# EAGLE design amp (EAGLE 7.7.0)
Odd man out headphone amplifier
CNAME: Odd Man Out Headphone Amplifier; CREVISION: 1; DESIGNER: Eugene Zagidullin
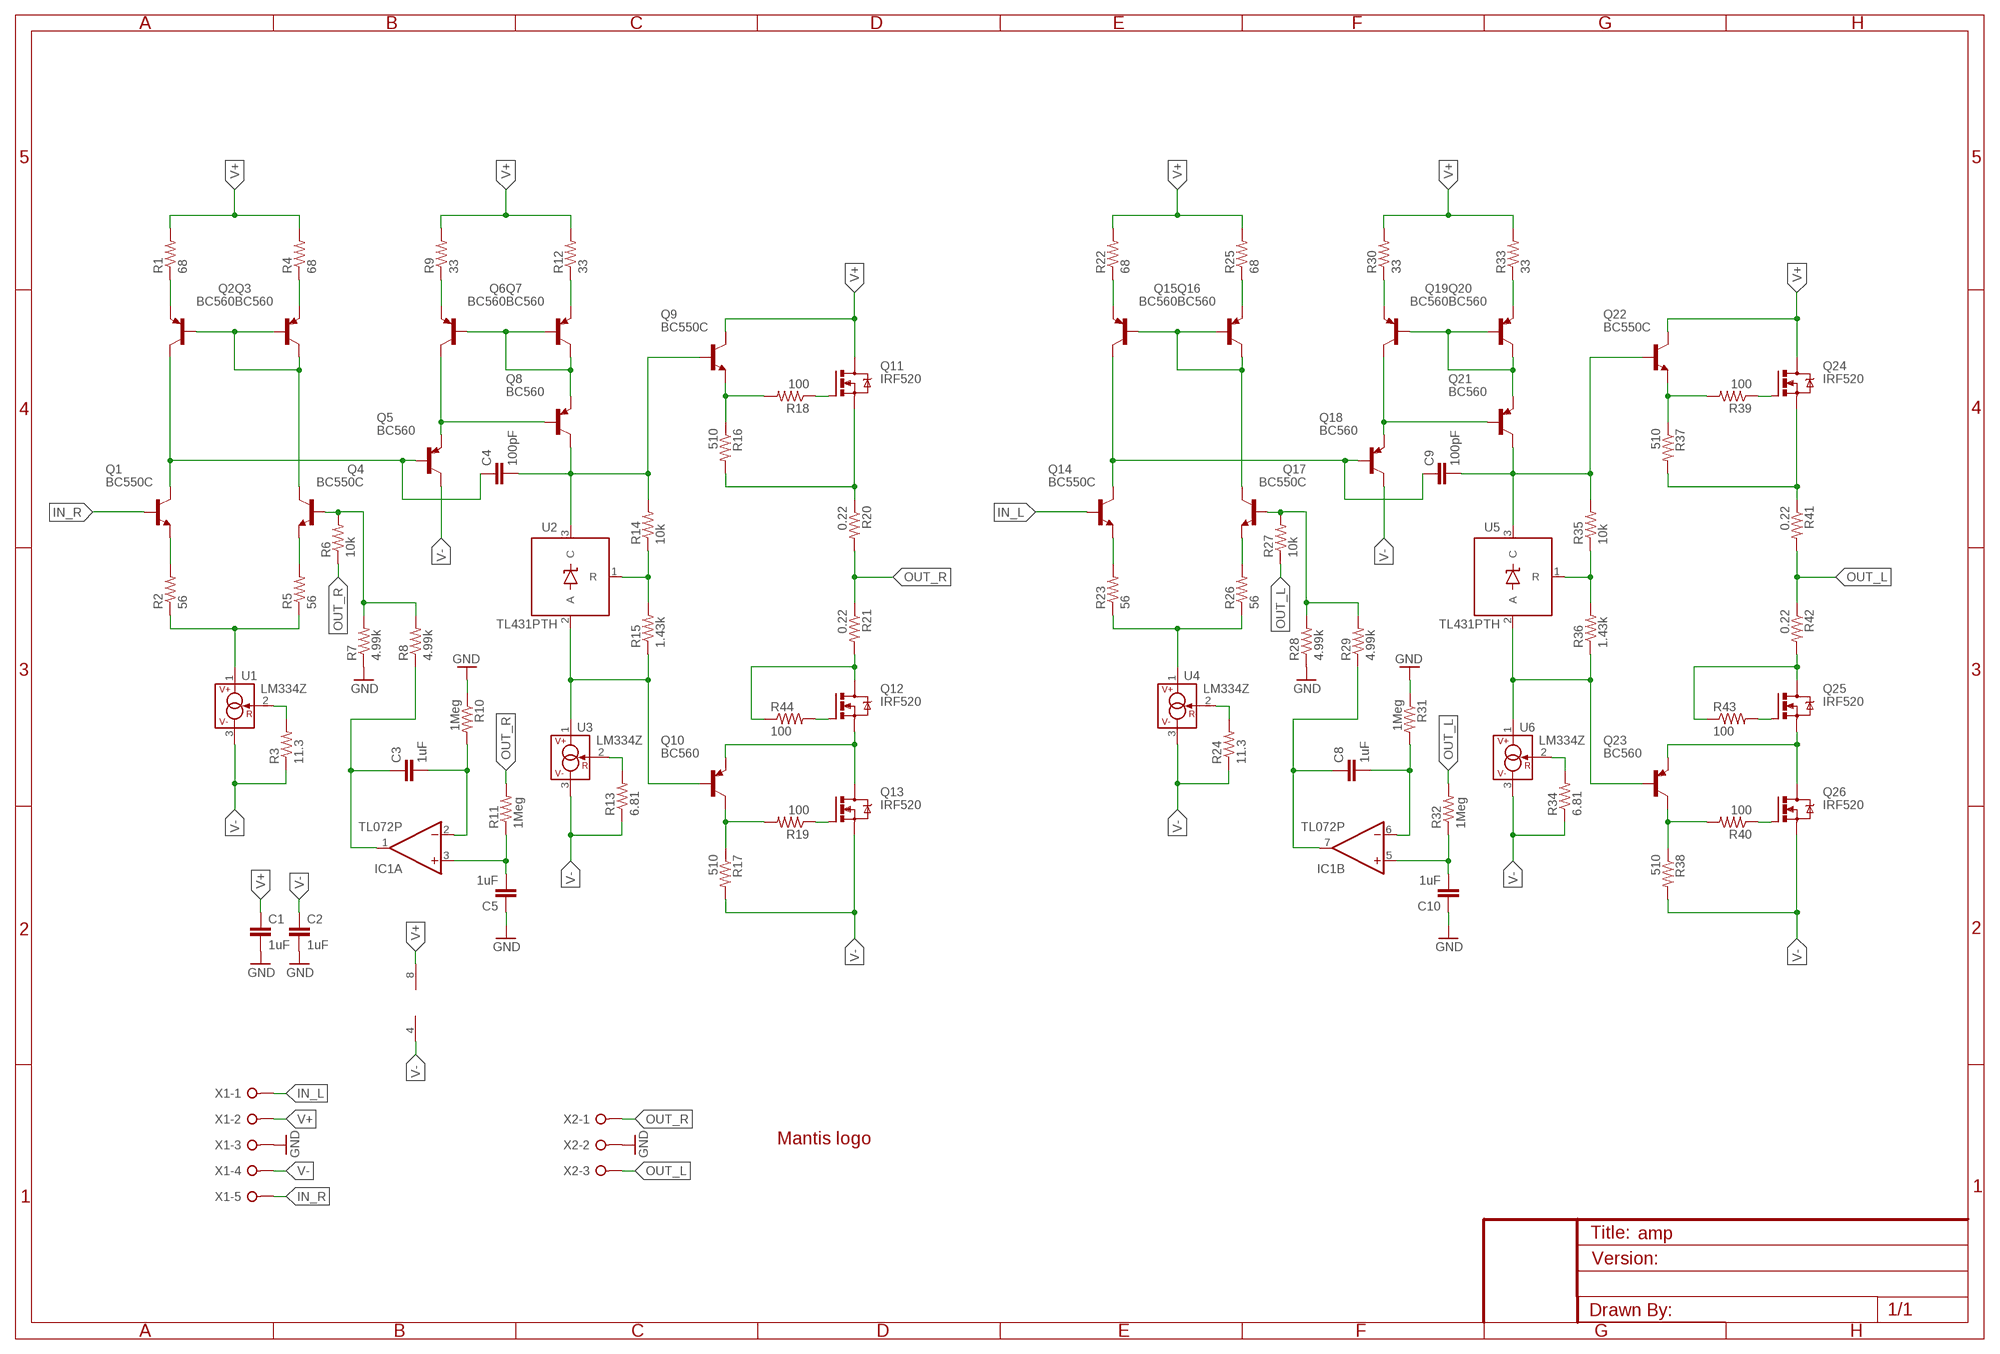
[diagram p0: schematic, sheet 1]

## Parts
C1  1uF  CAPPTH  [CAP-PTH-SMALL]
C2  1uF  CAPPTH  [CAP-PTH-SMALL]
C3  1uF  C5/5.5  [C5B5.5]
C4  100pF  C5/4.5  [C5B4.5]
C5  1uF  C5/5.5  [C5B5.5]
C8  1uF  C5/5.5  [C5B5.5]
C9  100pF  C5/4.5  [C5B4.5]
C10  1uF  C5/5.5  [C5B5.5]
IC1  TL072P  [DIL08]
LOGO1  LOGO-MANTIS  [LOGO-MANTIS]
Q1  BC550C  [TO92-EBC]
Q2  BC560  [TO92-EBC]
Q3  BC560  [TO92-EBC]
Q4  BC550C  [TO92-EBC]
Q5  BC560  [TO92-EBC]
Q6  BC560  [TO92-EBC]
Q7  BC560  [TO92-EBC]
Q8  BC560  [TO92-EBC]
Q9  BC550C  [TO92-EBC]
Q10  BC560  [TO92-EBC]
Q11  IRF520  [TO220BV]
Q12  IRF520  [TO220BV]
Q13  IRF520  [TO220BV]
Q14  BC550C  [TO92-EBC]
Q15  BC560  [TO92-EBC]
Q16  BC560  [TO92-EBC]
Q17  BC550C  [TO92-EBC]
Q18  BC560  [TO92-EBC]
Q19  BC560  [TO92-EBC]
Q20  BC560  [TO92-EBC]
Q21  BC560  [TO92-EBC]
Q22  BC550C  [TO92-EBC]
Q23  BC560  [TO92-EBC]
Q24  IRF520  [TO220BV]
Q25  IRF520  [TO220BV]
Q26  IRF520  [TO220BV]
R1  68  RESISTORPTH-1/4W  [AXIAL-0.4]
R2  56  RESISTORPTH-1/4W  [AXIAL-0.4]
R3  11.3  RESISTORPTH-1/4W  [AXIAL-0.4]
R4  68  RESISTORPTH-1/4W  [AXIAL-0.4]
R5  56  RESISTORPTH-1/4W  [AXIAL-0.4]
R6  10k  RESISTORPTH-1/4W  [AXIAL-0.4]
R7  4.99k  RESISTORPTH-1/4W  [AXIAL-0.4]
R8  4.99k  RESISTORPTH-1/4W  [AXIAL-0.4]
R9  33  RESISTORPTH-1/4W  [AXIAL-0.4]
R10  1Meg  RESISTORPTH-1/4W  [AXIAL-0.4]
R11  1Meg  RESISTORPTH-1/4W  [AXIAL-0.4]
R12  33  RESISTORPTH-1/4W  [AXIAL-0.4]
R13  6.81  RESISTORPTH-1/4W  [AXIAL-0.4]
R14  10k  RESISTORPTH-1/4W  [AXIAL-0.4]
R15  1.43k  RESISTORPTH-1/4W  [AXIAL-0.4]
R16  510  RESISTORPTH-1/4W  [AXIAL-0.4]
R17  510  RESISTORPTH-1/4W  [AXIAL-0.4]
R18  100  RESISTORPTH-1/4W  [AXIAL-0.4]
R19  100  RESISTORPTH-1/4W  [AXIAL-0.4]
R20  0.22  RESISTORPTH-1/4W  [AXIAL-0.4]
R21  0.22  RESISTORPTH-1/4W  [AXIAL-0.4]
R22  68  RESISTORPTH-1/4W  [AXIAL-0.4]
R23  56  RESISTORPTH-1/4W  [AXIAL-0.4]
R24  11.3  RESISTORPTH-1/4W  [AXIAL-0.4]
R25  68  RESISTORPTH-1/4W  [AXIAL-0.4]
R26  56  RESISTORPTH-1/4W  [AXIAL-0.4]
R27  10k  RESISTORPTH-1/4W  [AXIAL-0.4]
R28  4.99k  RESISTORPTH-1/4W  [AXIAL-0.4]
R29  4.99k  RESISTORPTH-1/4W  [AXIAL-0.4]
R30  33  RESISTORPTH-1/4W  [AXIAL-0.4]
R31  1Meg  RESISTORPTH-1/4W  [AXIAL-0.4]
R32  1Meg  RESISTORPTH-1/4W  [AXIAL-0.4]
R33  33  RESISTORPTH-1/4W  [AXIAL-0.4]
R34  6.81  RESISTORPTH-1/4W  [AXIAL-0.4]
R35  10k  RESISTORPTH-1/4W  [AXIAL-0.4]
R36  1.43k  RESISTORPTH-1/4W  [AXIAL-0.4]
R37  510  RESISTORPTH-1/4W  [AXIAL-0.4]
R38  510  RESISTORPTH-1/4W  [AXIAL-0.4]
R39  100  RESISTORPTH-1/4W  [AXIAL-0.4]
R40  100  RESISTORPTH-1/4W  [AXIAL-0.4]
R41  0.22  RESISTORPTH-1/4W  [AXIAL-0.4]
R42  0.22  RESISTORPTH-1/4W  [AXIAL-0.4]
R43  100  RESISTORPTH-1/4W  [AXIAL-0.4]
R44  100  RESISTORPTH-1/4W  [AXIAL-0.4]
U1  LM334Z  [TO-92]
U2  TL431PTH  [TO-92]
U3  LM334Z  [TO-92]
U4  LM334Z  [TO-92]
U5  TL431PTH  [TO-92]
U6  LM334Z  [TO-92]
X1  W237-05P  [W237-5P]
X2  W237-3E  [W237-3E]

## Nets
GND: C1.2 C2.2 C5.1 C10.1 R7.P$1 R10.P$1 R28.P$1 R31.P$1 X1.3 X2.2
IN_L: Q14.B X1.1
IN_R: Q1.B X1.5
N$1: Q2.B Q3.B Q3.C Q4.C
N$2: C4.1 Q1.C Q2.C Q5.B
N$3: Q2.E R1.P$1
N$4: Q3.E R4.P$1
N$5: Q1.E R2.P$2
N$6: Q4.E R5.P$2
N$7: R2.P$1 R5.P$1 U1.1(V+)
N$8: R3.P$2 U1.2(R)
N$9: Q6.B Q7.B Q7.C Q8.E
N$10: Q6.E R9.P$1
N$11: Q7.E R12.P$1
N$12: Q5.E Q6.C Q8.B
N$13: C4.2 Q8.C Q9.B R14.P$2 U2.3(C)
N$14: R14.P$1 R15.P$2 U2.1(R)
N$15: Q10.B R15.P$1 U2.2(A) U3.1(V+)
N$16: Q13.G R19.P$1
N$17: R13.P$2 U3.2(R)
N$18: Q10.C R17.P$1 R19.P$2
N$19: Q9.E R16.P$1 R18.P$2
N$20: Q11.G R18.P$1
N$21 [out]: Q10.E Q12.S Q13.D
N$22: C3.1 IC1.1(A:OUT) R8.P$1
N$23 [out]: Q11.S R16.P$2 R20.P$1
N$24: C3.2 IC1.2(A:-IN) R10.P$2
N$25 [out]: Q12.D R21.P$2 R44.P$1
N$26: C5.2 IC1.3(A:+IN) R11.P$1
N$27: Q15.B Q16.B Q16.C Q17.C
N$28: Q4.B R6.P$2 R7.P$2 R8.P$2
N$29: Q15.E R22.P$1
N$30: Q16.E R25.P$1
N$31: C9.1 Q14.C Q15.C Q18.B
N$32: Q14.E R23.P$2
N$33: Q17.E R26.P$2
N$34: R23.P$1 R26.P$1 U4.1(V+)
N$35: R24.P$2 U4.2(R)
N$36: Q19.B Q20.B Q20.C Q21.E
N$37: Q19.E R30.P$1
N$38: Q20.E R33.P$1
N$39: Q18.E Q19.C Q21.B
N$40: C9.2 Q21.C Q22.B R35.P$2 U5.3(C)
N$41: R35.P$1 R36.P$2 U5.1(R)
N$42: Q23.B R36.P$1 U5.2(A) U6.1(V+)
N$43: R34.P$2 U6.2(R)
N$44: Q25.G R43.P$2
N$45: Q12.G R44.P$2
N$48 [out]: Q23.E Q25.S Q26.D
N$49 [out]: Q24.S R37.P$2 R41.P$1
N$50 [out]: Q25.D R42.P$2 R43.P$1
N$51: C8.1 IC1.7(B:OUT) R29.P$1
N$52: C8.2 IC1.6(B:-IN) R31.P$2
N$53: C10.2 IC1.5(B:+IN) R32.P$1
N$54: Q17.B R27.P$2 R28.P$2 R29.P$2
N$1044: Q26.G R40.P$1
N$1045: Q23.C R38.P$1 R40.P$2
N$1046: Q22.E R37.P$1 R39.P$2
N$1047: Q24.G R39.P$1
OUT_L [out]: R27.P$1 R32.P$2 R41.P$2 R42.P$1 X2.3
OUT_R [out]: R6.P$1 R11.P$2 R20.P$2 R21.P$1 X2.1
V+ [pwr]: C1.1 IC1.8(P:V+) Q9.C Q11.D Q22.C Q24.D R1.P$2 R4.P$2 R9.P$2 R12.P$2 R22.P$2 R25.P$2 R30.P$2 R33.P$2 X1.2
V- [pwr]: C2.1 IC1.4(P:V-) Q5.C Q13.S Q18.C Q26.S R3.P$1 R13.P$1 R17.P$2 R24.P$1 R34.P$1 R38.P$2 U1.3(V-) U3.3(V-) U4.3(V-) U6.3(V-) X1.4

## Library data of the parts
C1 C2 = SparkFun-Capacitors:CAP: Capacitor Standard 0603 ceramic capacitor, and 0.1" leaded capacitor.
C3-C5 C8-C10 = capacitor-wima:C: CAPACITOR naming: grid - package width
IC1 = linear:TL072: OP AMP
LOGO1 = my:LOGO-MANTIS: Mantis logo
Q1 Q4 Q9 Q14 Q17 Q22 = transistor-npn:BC550*: NPN Transistor
Q2 Q3 Q5-Q8 Q10 Q15 Q16 Q18-Q21 Q23 = transistor-pnp:BC560*: PNP Transistror
Q11-Q13 Q24-Q26 = transistor-power:IRF520: HEXFET Power MOSFET
R1-R44 = SparkFun-Resistors:RESISTOR: Resistor Basic schematic elements and footprints for 0603, 1206, and PTH resistors.
U1 U3 U4 U6 = my:LM334Z: 3-Terminal Adjustable Current Sources Source: www.national.com/pf/LM/LM334.html | LM134.pdf
U2 U5 = SparkFun-AnalogIC:TL431: Precision Programmable Reference
X1 = con-wago-508:W237-05P: WAGO SREW CLAMP; OC_FARNELL: unknown; OC_NEWARK: unknown
X2 = con-wago-508:W237-3E: WAGO SREW CLAMP; OC_FARNELL: unknown; OC_NEWARK: unknown

## Net classes
0 default: width 0.61 mm
1 pwr: width 1.27 mm
2 out: width 0.813 mm

## Board
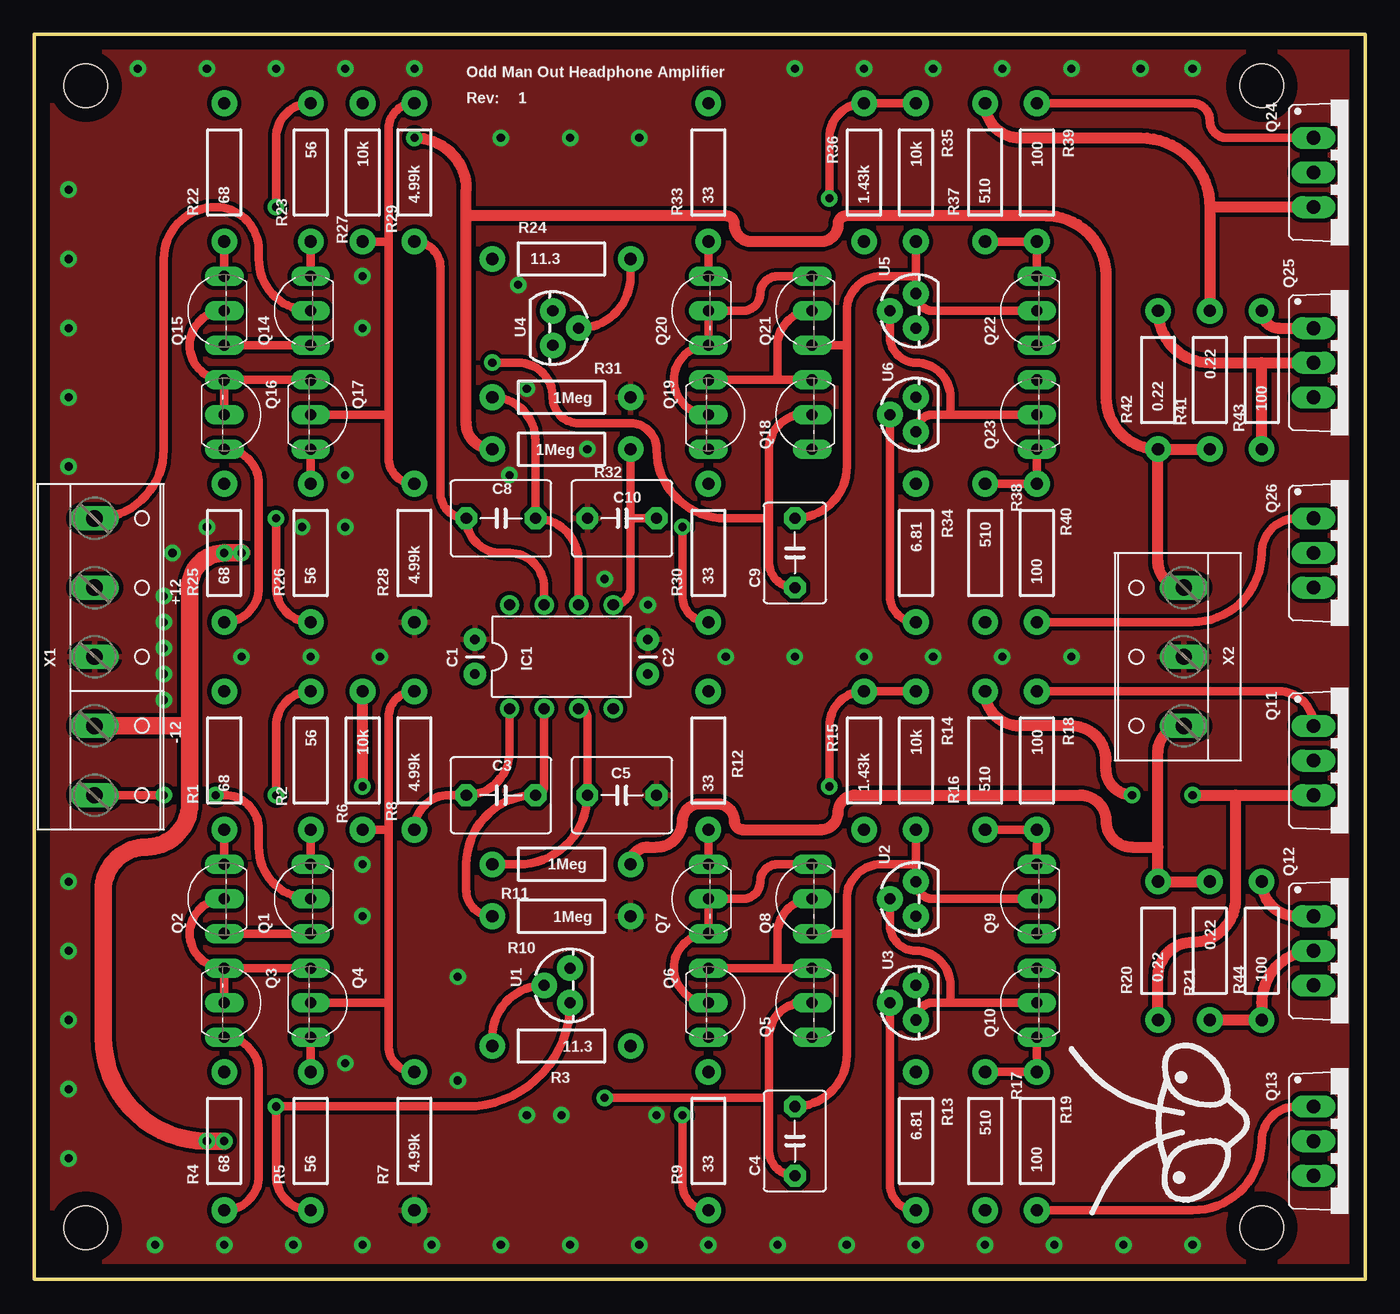
[diagram p1: board, top side]
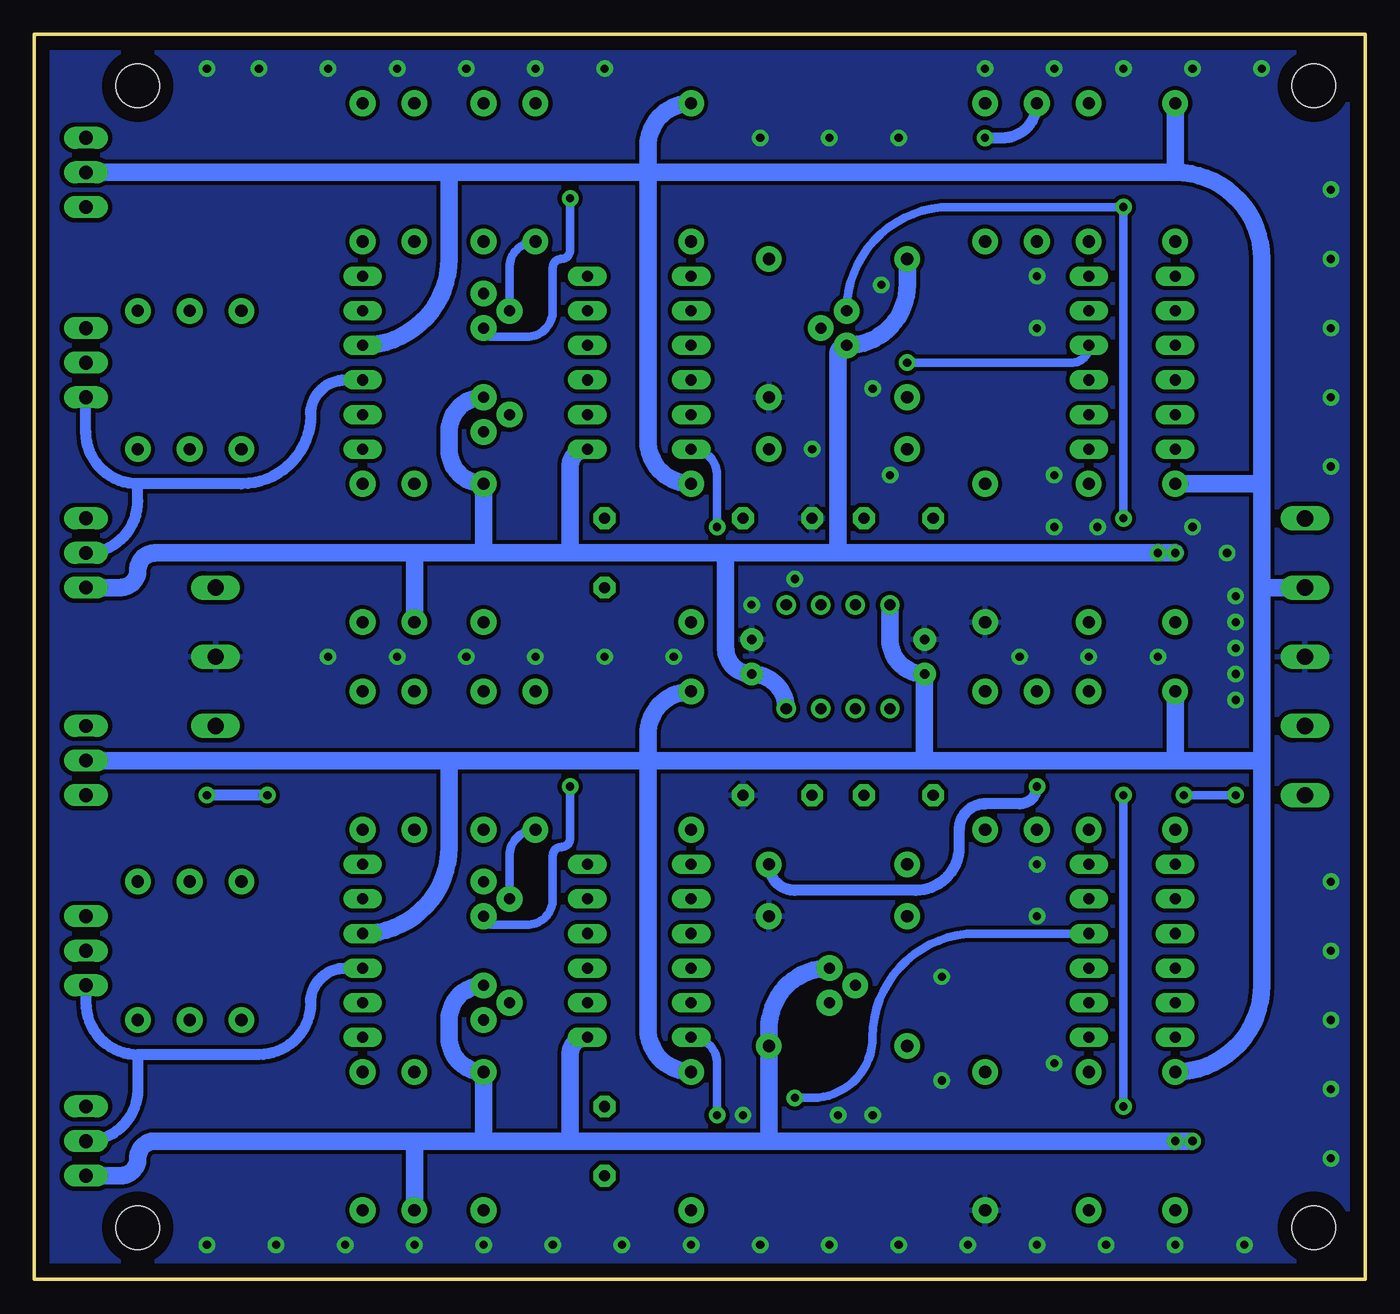
[diagram p2: board, bottom side, seen from below]

Size 97.79 x 91.44 mm. Coordinates in mm from the lower left corner, seen from the top.
Outline: 97.79,0 97.79,91.44 0,91.44 0,0 97.79,0
Copper layers (1*16): Top 0.035mm / dielectric 1.5mm / Bottom 0.035mm
Design rules "default *": minimum track width 12mil, minimum drill 22mil, track to track 12mil, track to pad 12mil, pad to pad 8mil, via to via 8mil, smd to smd 0mil, copper to edge 40mil, drill to drill 12mil, minimum pad ring 12mil, minimum via ring 12mil, stop-mask expansion 4mil, vias tented up to drill 0mil, thermal gap 10mil
Holes 3.2 mm at 3.81,3.81 90.17,3.81 3.81,87.63 90.17,87.63

### Footprints (pad centres in the part's own frame; a part is rotated, then mirrored left to right if it is on the bottom)
CAP-PTH-SMALL = drill 0.7 pad 1.651: 1 0,0; 2 2.54,0
C5B5.5 = drill 0.813 pad 1.6 octagon: 1 -2.54,0; 2 2.54,0
C5B4.5 = drill 0.813 pad 1.6 octagon: 1 -2.54,0; 2 2.54,0
DIL08 = drill 0.813 pad 1.27: 1 -3.81,-3.81; 2 -1.27,-3.81; 3 1.27,-3.81; 4 3.81,-3.81; 5 3.81,3.81; 6 1.27,3.81; 7 -1.27,3.81; 8 -3.81,3.81
TO92-EBC = drill 0.813 long: B 0,-1.27; C -2.54,-1.27; E 2.54,-1.27
TO220BV = drill 1.016 long: D 0,-2.54; G -2.54,-2.54; S 2.54,-2.54
AXIAL-0.4 = drill 0.9 pad 1.88: P$1 -5.08,0; P$2 5.08,0
TO-92 = drill 0.813 pad 1.88: 1 -1.27,0; 2 0,1.905; 3 1.27,0
W237-5P = drill 1.194 long: 1 -10.16,-0.635; 2 -5.08,-0.635; 3 0,-0.635; 4 5.08,-0.635; 5 10.16,-0.635
W237-3E = drill 1.194 long: 1 -5.08,-0.635; 2 0,-0.635; 3 5.08,-0.635

### Placement (x,y rotation side)
C1  32.38,44.45 90 top
C2  45.09,44.45 90 top
C3  34.29,35.56 0 top
C4  55.88,10.16 90 top
C5  43.18,35.56 180 top
C8  34.29,55.88 0 top
C9  55.88,53.34 90 top
C10  43.18,55.88 0 top
IC1  38.73,45.72 0 top
LOGO1  82.55,11.43 90 top
Q1  19.05,27.94 90 top
Q2  12.7,27.94 90 top
Q3  15.24,20.32 270 top
Q4  21.59,20.32 270 top
Q5  55.88,20.32 90 top
Q6  50.8,20.32 270 top
Q7  48.26,27.94 90 top
Q8  55.88,27.94 90 top
Q9  72.39,27.94 90 top
Q10  72.39,20.32 90 top
Q11  96.52,38.1 270 top
Q12  96.52,24.13 270 top
Q13  96.52,10.16 270 top
Q14  19.05,71.12 90 top
Q15  12.7,71.12 90 top
Q16  15.24,63.5 270 top
Q17  21.59,63.5 270 top
Q18  55.88,63.5 90 top
Q19  50.8,63.5 270 top
Q20  48.26,71.12 90 top
Q21  55.88,71.12 90 top
Q22  72.39,71.12 90 top
Q23  72.39,63.5 90 top
Q24  96.52,81.28 270 top
Q25  96.52,67.31 270 top
Q26  96.52,53.34 270 top
R1  13.97,38.1 90 top
R2  20.32,38.1 270 top
R3  38.73,17.14 180 top
R4  13.97,10.16 90 top
R5  20.32,10.16 90 top
R6  24.13,38.1 270 top
R7  27.94,10.16 90 top
R8  27.94,38.1 90 top
R9  49.53,10.16 90 top
R10  38.73,26.67 180 top
R11  38.73,30.48 0 top
R12  49.53,38.1 90 top
R13  64.77,10.16 270 top
R14  64.77,38.1 270 top
R15  60.96,38.1 90 top
R16  69.85,38.1 90 top
R17  69.85,10.16 270 top
R18  73.66,38.1 270 top
R19  73.66,10.16 90 top
R20  82.55,24.13 90 top
R21  86.36,24.13 270 top
R22  13.97,81.28 90 top
R23  20.32,81.28 270 top
R24  38.73,74.93 0 top
R25  13.97,53.34 90 top
R26  20.32,53.34 90 top
R27  24.13,81.28 270 top
R28  27.94,53.34 90 top
R29  27.94,81.28 90 top
R30  49.53,53.34 90 top
R31  38.73,64.77 180 top
R32  38.73,60.96 180 top
R33  49.53,81.28 90 top
R34  64.77,53.34 270 top
R35  64.77,81.28 270 top
R36  60.96,81.28 90 top
R37  69.85,81.28 90 top
R38  69.85,53.34 270 top
R39  73.66,81.28 270 top
R40  73.66,53.34 90 top
R41  86.36,66.04 270 top
R42  82.55,66.04 90 top
R43  90.17,66.04 90 top
R44  90.17,24.13 90 top
U1  39.37,21.59 90 top
U2  64.77,27.94 90 top
U3  64.77,20.32 90 top
U4  38.1,69.85 270 top
U5  64.77,71.12 90 top
U6  64.77,63.5 90 top
X1  5.08,45.72 270 top
X2  83.82,45.72 90 top

### Tracks (layer width: path | path; a pad name or v marks a point on that pad's centre or on a via)
GND  (via drill 0.6)
  other vias: 24.13,26.67 24.13,30.48 22.86,15.88 19.68,55.24 22.86,55.24 24.13,73.66 22.86,59.05 8.89,2.54 13.97,2.54 19.05,2.54 24.13,2.54 29.21,2.54 34.29,2.54 39.37,2.54 44.45,2.54 49.53,2.54 54.61,2.54 59.69,2.54 64.77,2.54 69.85,2.54 74.93,2.54 80.01,2.54 85.09,2.54 2.54,8.89 2.54,13.97 2.54,19.05 2.54,24.13 2.54,29.21 9.53,42.55 9.53,44.45 9.53,46.35 9.53,48.26 9.53,50.16 10.16,53.34 12.7,55.24 2.54,59.69 2.54,64.77 2.54,69.85 2.54,74.93 2.54,80.01 7.62,88.9 12.7,88.9 17.78,88.9 22.86,88.9 27.94,88.9 55.88,88.9 60.96,88.9 66.04,88.9 71.12,88.9 76.2,88.9 81.28,88.9 85.09,88.9 15.24,45.72 20.32,45.72 25.4,45.72 50.8,45.72 55.88,45.72 60.96,45.72 66.04,45.72 71.12,45.72 76.2,45.72 34.29,83.82 39.37,83.82 44.45,83.82 24.13,69.85 41.91,51.43 45.09,49.53 34.92,59.05 36.2,65.41 40.64,60.96 35.56,73.02 36.2,12.07 38.73,12.07 45.72,12.07 31.11,14.61 31.11,22.23
  pour Top (isolate 0.305): 0,91.44 97.79,91.44 97.79,0 0,0
  pour Bottom (isolate 0.305): 0,91.44 97.79,91.44 97.79,0 0,0
IN_L
  Top 0.61: Q14.B arc-90 16.51,74.93 16.51,75.56 arc90 13.34,78.74 arc90 9.53,74.93 9.53,60.96 arc-90 X1.1
IN_R  (via drill 0.6)
  Top 0.61: Q1.B arc-90 16.51,31.75 16.51,33.02 arc90 13.97,35.56 v13.34,35.56 | X1.5 v9.53,35.56
  Bottom 0.61: v9.53,35.56 v13.34,35.56
N$1
  Top 0.61: Q3.C Q4.C | Q3.C Q3.B | Q3.C arc-90 11.43,25.4 arc-90 Q2.B
N$2  (via drill 0.6)
  Top 0.61: Q2.C Q1.C | 55.88,20.32 Q5.B 56.52,20.32 arc90 53.98,17.78 53.98,13.34 | 53.98,13.34 53.98,9.53 arc90 C4.1 | v41.91,13.34 53.98,13.34
  Bottom 0.61: Q1.C 28.57,25.4 arc-90 36.2,17.78 arc90 40.64,13.34 v41.91,13.34
N$3
  Top 0.61: Q2.E R1.P$1
N$4
  Top 0.61: R4.P$1 arc90 16.51,7.62 16.51,15.24 arc90 Q3.E
N$5
  Top 0.61: Q1.E R2.P$2
N$6
  Top 0.61: Q4.E R5.P$2
N$7  (via drill 0.6)
  Top 0.61: R5.P$1 arc-90 17.78,7.62 v17.78,12.7 31.75,12.7 arc90 U1.1 | v17.78,35.56 17.78,40.64 arc-90 R2.P$1
  Bottom 0.61: v17.78,12.7 v17.78,35.56
N$8
  Top 0.61: U1.2 arc90 33.66,17.78 R3.P$2
N$9
  Top 0.61: Q8.E 54.61,30.48 arc90 53.34,29.21 arc-90 52.07,27.94 Q7.B Q7.C arc90 46.99,22.86 arc90 Q6.B
N$10  (via drill 0.6)
  Top 0.61: R9.P$1 arc-90 47.62,6.99 v47.62,12.07
  Bottom 0.61: v47.62,12.07 47.62,15.88 arc-90 Q6.E
N$11
  Top 0.61: Q7.E R12.P$1
N$12
  Top 0.61: Q6.C 54.61,22.86 | 54.61,22.86 Q5.E | Q8.B arc90 54.61,25.4 54.61,22.86
N$13
  Top 0.61: C4.2 arc90 59.69,16.51 59.69,25.4 | 59.69,25.4 59.69,27.94 arc-90 62.23,30.48 64.77,30.48 | 64.77,30.48 U2.3 arc90 66.04,27.94 Q9.B | 64.77,30.48 R14.P$2 | Q8.C 59.69,25.4
N$14  (via drill 0.6)
  Top 0.61: v58.42,36.2 58.42,40.64 arc-90 R15.P$2 R14.P$1
  Bottom 0.61: U2.1 arc-90 64.14,26.03 61.59,26.03 arc-90 59.69,27.94 59.69,31.12 arc90 59.05,31.75 arc-90 58.42,32.38 v58.42,36.2
N$15
  Top 0.61: U3.1 arc-90 66.04,20.32 67.31,20.32 | 67.31,20.32 Q10.B | U2.2 62.87,26.03 arc90 64.77,24.13 arc-90 67.31,21.59 67.31,20.32
  Bottom 0.61: U2.2 62.87,31.12 arc90 R15.P$1
N$16
  Top 0.61: R19.P$1 85.09,5.08 arc90 90.17,10.16 arc-90 92.71,12.7 Q13.G
N$17
  Top 0.61: R13.P$2 arc-90 62.87,6.99 U3.2
N$18
  Top 0.61: Q10.C R19.P$2 R17.P$1
N$19
  Top 0.61: R16.P$1 R18.P$2 Q9.E
N$20
  Top 0.61: R18.P$1 91.44,43.18 arc-90 Q11.G
N$21
  Bottom 0.813: Q10.E 74.93,22.86 arc-90 77.47,20.32 arc90 81.28,16.51 90.17,16.51 | Q12.S 93.98,20.32 arc-90 90.17,16.51 | 90.17,16.51 90.17,13.97 arc90 Q13.D
N$22
  Top 0.61: IC1.1 34.92,38.73 arc-90 C3.1 30.48,35.56 arc90 R8.P$1
N$23  (via drill 0.6)
  Top 0.813: R20.P$1 82.55,22.23 arc-90 85.09,24.77 arc90 88.27,27.94 88.27,35.56 | R16.P$2 arc90 72.39,40.64 76.2,40.64 arc-90 78.74,38.1 78.74,37.46 arc90 v80.65,35.56 | v85.09,35.56 88.27,35.56 | 88.27,35.56 Q11.S
  Bottom 0.813: v80.65,35.56 v85.09,35.56
N$24
  Top 0.61: IC1.2 37.46,36.2 arc-90 C3.2 arc90 31.75,30.48 31.75,28.58 arc90 R10.P$2
N$25
  Top 0.813: Q12.D arc90 90.17,20.32 R44.P$1 R21.P$2
N$26
  Top 0.61: IC1.3 arc-90 40.64,41.27 C5.2 arc-90 35.56,30.48 R11.P$1
N$27
  Top 0.61: Q16.C Q17.C | Q16.C Q16.B | Q16.C arc-90 11.43,68.58 arc-90 Q15.B
N$28
  Top 0.61: R7.P$2 arc-90 26.04,17.14 26.04,20.32 | 26.04,20.32 26.04,33.02 | 26.04,33.02 26.04,41.27 arc-90 R8.P$2 | Q4.B 26.04,20.32 | R6.P$2 26.04,33.02
N$29
  Top 0.61: Q15.E R22.P$1
N$30
  Top 0.61: R25.P$1 arc90 16.51,50.8 16.51,58.42 arc90 Q16.E
N$31  (via drill 0.6)
  Top 0.61: Q15.C Q14.C | 55.88,63.5 Q18.B 56.52,63.5 arc90 53.98,60.96 53.98,55.88 | 53.98,55.88 53.98,52.7 arc90 C9.1 | v33.66,67.31 35.56,67.31 arc-90 38.1,64.77 arc90 40.01,62.86 43.81,62.86 arc-90 45.72,60.96 arc90 50.8,55.88 53.98,55.88
  Bottom 0.61: Q14.C arc90 21.59,67.31 v33.66,67.31
N$32
  Top 0.61: Q14.E R23.P$2
N$33
  Top 0.61: Q17.E R26.P$2
N$34  (via drill 0.6)
  Top 0.61: R26.P$1 arc-90 17.78,50.8 v17.78,55.88 | v17.78,78.74 17.78,83.82 arc-90 R23.P$1
  Bottom 0.61: v17.78,55.88 v17.78,78.74 30.48,78.74 arc-90 U4.1
N$35
  Top 0.61: U4.2 arc90 43.81,73.66 R24.P$2
N$36
  Top 0.61: Q21.E 54.61,73.66 arc90 53.34,72.39 arc-90 52.07,71.12 Q20.B Q20.C arc90 46.99,66.04 arc90 Q19.B
N$37  (via drill 0.6)
  Top 0.61: R30.P$1 arc-90 47.62,50.16 v47.62,55.24
  Bottom 0.61: v47.62,55.24 47.62,59.05 arc-90 Q19.E
N$38
  Top 0.61: Q20.E R33.P$1
N$39
  Top 0.61: Q19.C 54.61,66.04 | 54.61,66.04 Q18.E | Q21.B arc90 54.61,68.58 54.61,66.04
N$40
  Top 0.61: C9.2 arc90 59.69,59.69 59.69,68.58 | 59.69,68.58 59.69,71.12 arc-90 62.23,73.66 64.77,73.66 | 64.77,73.66 U5.3 arc90 66.04,71.12 Q22.B | 64.77,73.66 R35.P$2 | Q21.C 59.69,68.58
N$41  (via drill 0.6)
  Top 0.61: v58.42,79.38 58.42,83.82 arc-90 R36.P$2 R35.P$1
  Bottom 0.61: U5.1 arc-90 64.14,69.22 61.59,69.22 arc-90 59.69,71.12 59.69,74.3 arc90 59.05,74.93 arc-90 58.42,75.56 v58.42,79.38
N$42
  Top 0.61: U6.1 arc-90 66.04,63.5 67.31,63.5 | 67.31,63.5 Q23.B | U5.2 62.87,69.22 arc90 64.77,67.31 arc-90 67.31,64.77 67.31,63.5
  Bottom 0.61: U5.2 62.87,74.3 arc90 R36.P$1
N$43
  Top 0.61: R34.P$2 arc-90 62.87,50.16 U6.2
N$44
  Top 0.813: R43.P$2 arc90 91.44,69.85 Q25.G
N$45
  Top 0.813: R44.P$2 arc90 92.71,26.67 Q12.G
N$48
  Bottom 0.813: Q26.D arc-90 90.17,57.15 90.17,58.42 | Q23.E 74.93,66.04 arc-90 77.47,63.5 arc90 82.55,58.42 90.17,58.42 | 90.17,58.42 arc90 93.98,62.23 Q25.S
N$49
  Top 0.813: R37.P$2 arc90 72.39,83.82 81.28,83.82 arc-90 86.36,78.74 | 86.36,78.74 R41.P$1 | Q24.S 86.36,78.74
N$50
  Top 0.813: R42.P$2 arc90 86.36,67.31 90.17,67.31 | 90.17,67.31 Q25.D | R43.P$1 90.17,67.31
N$51
  Top 0.61: IC1.7 37.46,50.8 arc90 34.92,53.34 34.29,53.34 arc-90 C8.1 arc-90 29.84,57.78 29.84,74.3 arc90 R29.P$1
N$52
  Top 0.61: IC1.6 40.01,52.7 arc90 C8.2 36.83,61.59 arc90 R31.P$2
N$53
  Top 0.61: IC1.5 arc90 43.81,50.8 43.81,55.88 | 43.81,55.88 R32.P$1 | C10.2 43.81,55.88
N$54
  Top 0.61: R28.P$2 arc-90 26.04,60.32 26.04,63.5 | 26.04,63.5 26.04,76.2 | 26.04,76.2 26.04,84.45 arc-90 R29.P$2 | Q17.B 26.04,63.5 | R27.P$2 26.04,76.2
N$1044
  Top 0.61: R40.P$1 85.09,48.26 arc90 90.17,53.34 arc-90 92.71,55.88 Q26.G
N$1045
  Top 0.61: Q23.C R40.P$2 R38.P$1
N$1046
  Top 0.61: R37.P$1 R39.P$2 Q22.E
N$1047
  Top 0.61: R39.P$1 85.09,86.36 arc-90 86.36,85.09 arc90 87.63,83.82 Q24.G
OUT_L  (via drill 0.6)
  Top 0.813: R32.P$2 arc-90 31.75,62.86 31.75,78.11 | 31.75,78.11 31.75,80.01 arc90 v27.94,83.82 | 31.75,78.11 50.8,78.11 arc-90 51.44,77.47 arc90 52.7,76.2 57.78,76.2 arc90 59.05,77.47 arc-90 59.69,78.11 74.3,78.11 arc-90 78.74,73.66 78.74,64.77 arc90 R42.P$1 | X2.3 arc-90 82.55,52.7 R42.P$1 | R42.P$1 R41.P$2
  Bottom 0.813: v27.94,83.82 26.67,83.82 arc-90 R27.P$1
OUT_R  (via drill 0.6)
  Top 0.813: v24.13,36.2 R6.P$1 | R11.P$2 arc-90 45.09,31.75 45.72,31.75 arc90 47.62,33.66 arc-90 48.89,34.92 50.16,34.92 arc-90 51.44,33.66 arc90 52.07,33.02 57.78,33.02 arc90 59.05,34.29 arc-90 60.32,35.56 76.84,35.56 arc-90 78.74,33.66 arc90 80.65,31.75 82.55,31.75 | R21.P$1 R20.P$2 82.55,31.75 | 82.55,31.75 82.55,38.73 arc-90 X2.1
  Bottom 0.813: v24.13,36.2 arc90 25.4,34.92 27.94,34.92 arc-90 29.84,33.02 29.84,31.75 arc90 33.02,28.58 41.91,28.58 arc90 R11.P$2
V+
  Bottom 1.27: 13.97,38.1 33.02,38.1 | 33.02,38.1 52.7,38.1 | R1.P$2 13.97,38.1 | Q9.C arc-90 67.31,31.75 67.31,38.1 | R9.P$2 arc90 52.7,18.41 52.7,38.1 | R22.P$2 13.97,81.28 | Q22.C arc-90 67.31,74.93 67.31,81.28 | R30.P$2 arc90 52.7,61.59 52.7,81.28 | 7.62,58.42 7.62,74.93 arc-90 13.97,81.28 | 7.62,58.42 7.62,50.8 | 7.62,50.8 7.62,38.1 | 7.62,38.1 7.62,21.59 arc90 R4.P$2 | 13.97,38.1 7.62,38.1 | R25.P$2 7.62,58.42 | 13.97,81.28 52.7,81.28 | IC1.8 34.92,46.99 arc-90 C1.1 32.38,38.73 arc90 33.02,38.1 | X1.2 7.62,50.8 | Q11.D 67.31,38.1 | 67.31,38.1 52.7,38.1 | Q24.D 67.31,81.28 | 67.31,81.28 52.7,81.28 | R33.P$2 arc-90 52.7,83.19 52.7,81.28 | R12.P$2 arc-90 52.7,40 52.7,38.1
V-  (via drill 0.6)
  Top 1.27: v13.97,10.16 v12.7,10.16 arc-90 5.08,17.78 5.08,28.58 arc-90 8.25,31.75 arc90 11.43,34.92 11.43,40.64 | 14.03,53.34 v15.24,53.34 v13.97,53.34 arc90 11.43,50.8 11.43,40.64 | X1.4 11.43,40.64
  Bottom 1.27: v12.7,10.16 v13.97,10.16 43.81,10.16 | 43.81,10.16 58.42,10.16 | 58.42,10.16 64.77,10.16 | 64.77,10.16 R13.P$1 arc90 67.31,17.78 67.31,19.05 arc90 U3.3 | Q5.C arc-90 58.42,16.51 58.42,10.16 | 64.77,10.16 69.85,10.16 | 69.85,10.16 88.9,10.16 arc-90 90.17,8.89 arc90 91.44,7.62 Q13.S | R17.P$2 69.85,10.16 | v13.97,53.34 v15.24,53.34 38.73,53.34 | 38.73,53.34 46.99,53.34 | 46.99,53.34 58.42,53.34 | 58.42,53.34 64.77,53.34 | 64.77,53.34 R34.P$1 arc90 67.31,60.96 67.31,62.23 arc90 U6.3 | Q18.C arc-90 58.42,59.69 58.42,53.34 | 64.77,53.34 69.85,53.34 | 69.85,53.34 88.9,53.34 arc-90 90.17,52.07 arc90 91.44,50.8 Q26.S | R38.P$2 69.85,53.34 | IC1.4 arc-90 C2.1 arc90 46.99,46.35 46.99,53.34 | 43.81,10.16 R3.P$1 43.81,18.41 arc90 U1.3 | 38.73,53.34 38.73,67.95 arc90 U4.3 arc-90 33.66,73.02 R24.P$1

### Text on the board
tPlace: Rev: | +12 | -12